# EasyEDA schematic oLoRa-part-motherboard.json
TITLE: oLoRa-part-motherboard; REV: 1.0; Date: 2019-08-20; Sheet: 1/1; Drawn By: 김석현; Company: RMTEC
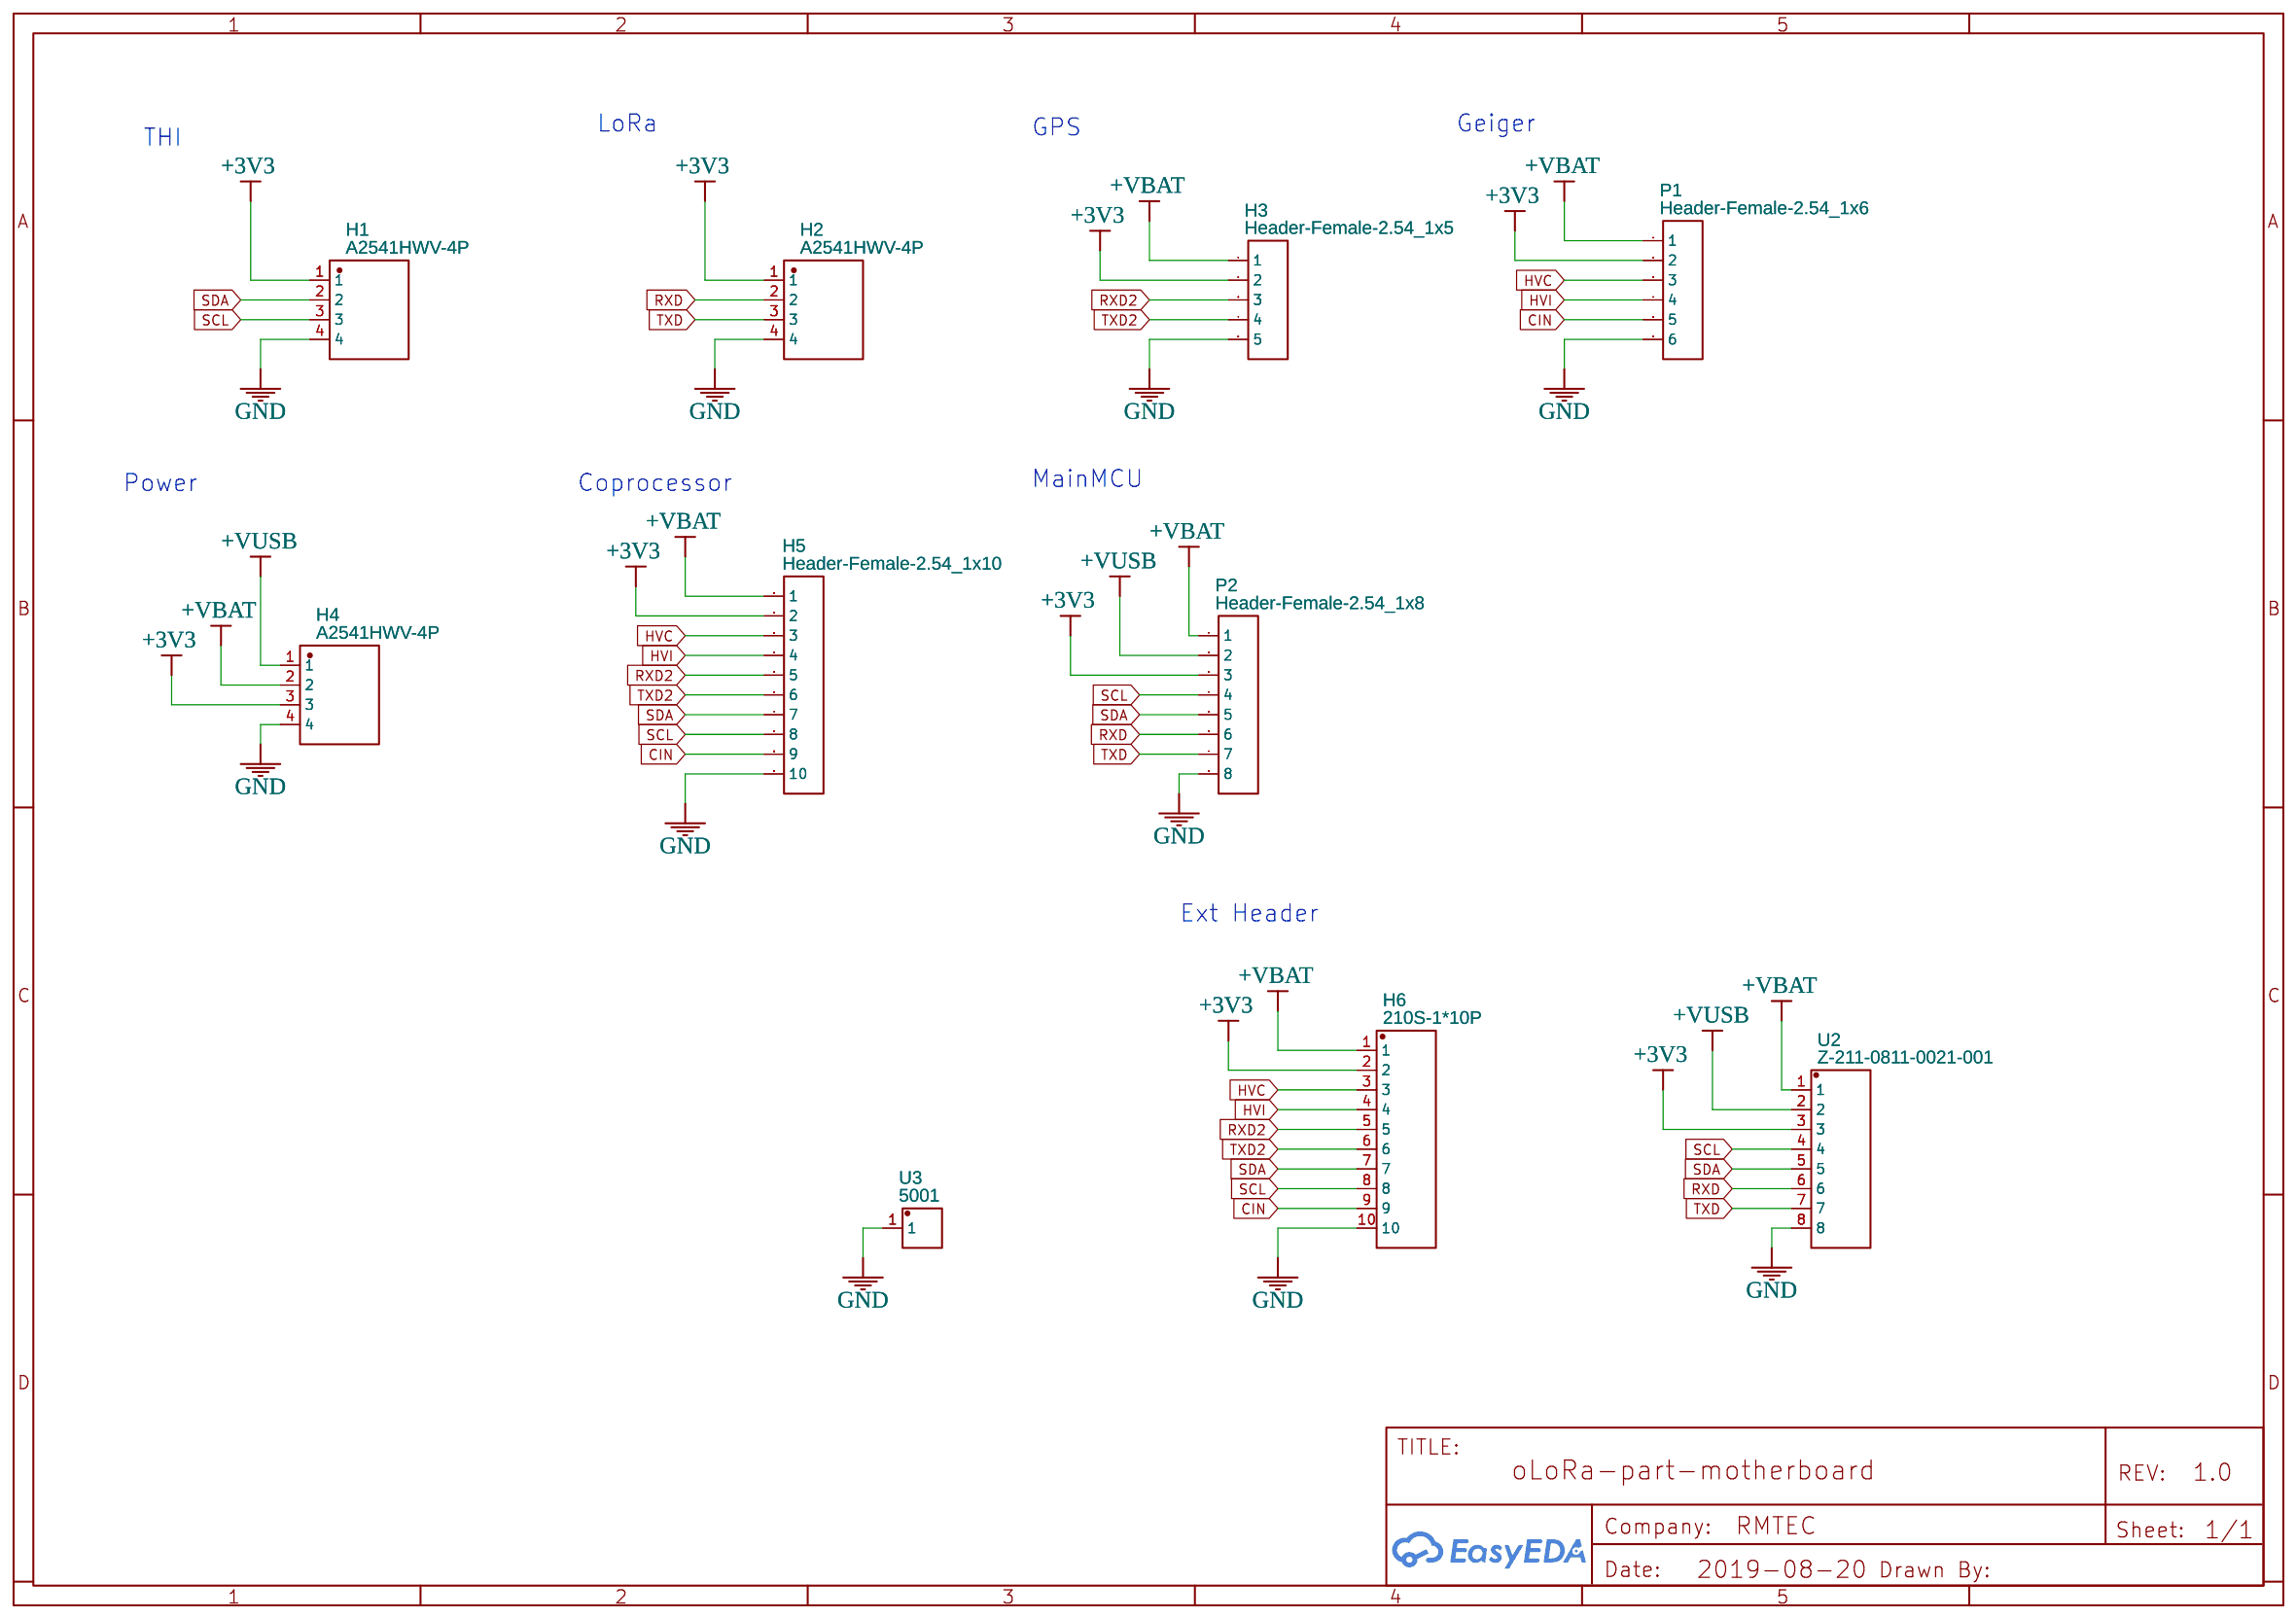
[diagram p0: schematic sheet]

## Parts
H1  A2541HWV-4P  [A2541HWV-4P]
H2  A2541HWV-4P  [A2541HWV-4P]
H3  Header-Female-2.54_1x5  [HDR-5X1/2.54]
H4  A2541HWV-4P  [A2541HWV-4P]
H5  Header-Female-2.54_1x10  [HDR-TH_10PIN-V-FEMALE-PITCH2.54]
H6  210S-1*10P  [210S-1X10P]
P1  Header-Female-2.54_1x6  [HDR-6X1/2.54]
P2  Header-Female-2.54_1x8  [HDR-8X1/2.54]
U2  Z-211-0811-0021-001  [SIP-2.54MM-8P-CJT-H8.54]
U3  5001  [CE-D-Z1.39-2.54]

## Library data of the parts
H1 H2 H4 = -: Supplier: LCSC; Supplier Part: C225501; Manufacturer: Changjiang Connectors; Contributor: LCSC
H3 = -: Supplier: LCSC; Manufacturer: BOOMELE; Manufacturer Part: 2.54mm 1*5p Female header; image: //image.lceda.cn/szlcsc/C50950.jpg; Supplier Part: C50950
H5 = -: Supplier: LCSC; Manufacturer: BOOMELE; Manufacturer Part: 2.54mm 1*10P Straight Female header Gold-plated; Supplier Part: C35445
H6 = -: Supplier: LCSC; Manufacturer: Ckmtw; Manufacturer Part: 210S-1*10P L=11.6MMGold-plated black; Contributor: LCSC; Supplier Part: C124372
P1 = -: Supplier: LCSC; Manufacturer: BOOMELE; Manufacturer Part: Female header 1*6p; Supplier Part: C40877
P2 = -: Supplier: LCSC; Manufacturer: BOOMELE; Manufacturer Part: Female headerHDR1X8-2.54; Supplier Part: C27438
U2 = -: Supplier: LCSC; Supplier Part: C190820; Manufacturer: Nextronics Engineering; Contributor: LCSC
U3 = -: Supplier: LCSC; Supplier Part: C238122; Manufacturer: Keystone; Contributor: LCSC

## Nets
+3V3: H1.1 H2.1 H3.2 H4.3 H5.2 H6.2 P1.2 P2.3 U2.3
+VBAT: H3.1 H4.2 H5.1 H6.1 P1.1 P2.1 U2.1
GND: H1.4 H2.4 H3.5 H4.4 H5.10 H6.10 P1.6 P2.8 U2.8 U3.1
+VUSB: H4.1 P2.2 U2.2
CIN: H5.9 H6.9 P1.5
HVC: H5.3 H6.3 P1.3
HVI: H5.4 H6.4 P1.4
RXD: H2.2 P2.6 U2.6
RXD2: H3.3 H5.5 H6.5
SCL: H1.3 H5.8 H6.8 P2.4 U2.4
SDA: H1.2 H5.7 H6.7 P2.5 U2.5
TXD: H2.3 P2.7 U2.7
TXD2: H3.4 H5.6 H6.6

## Notes on the sheet
- LoRa
- Geiger
- THI
- GPS
- Power
- Coprocessor
- MainMCU
- Ext Header
